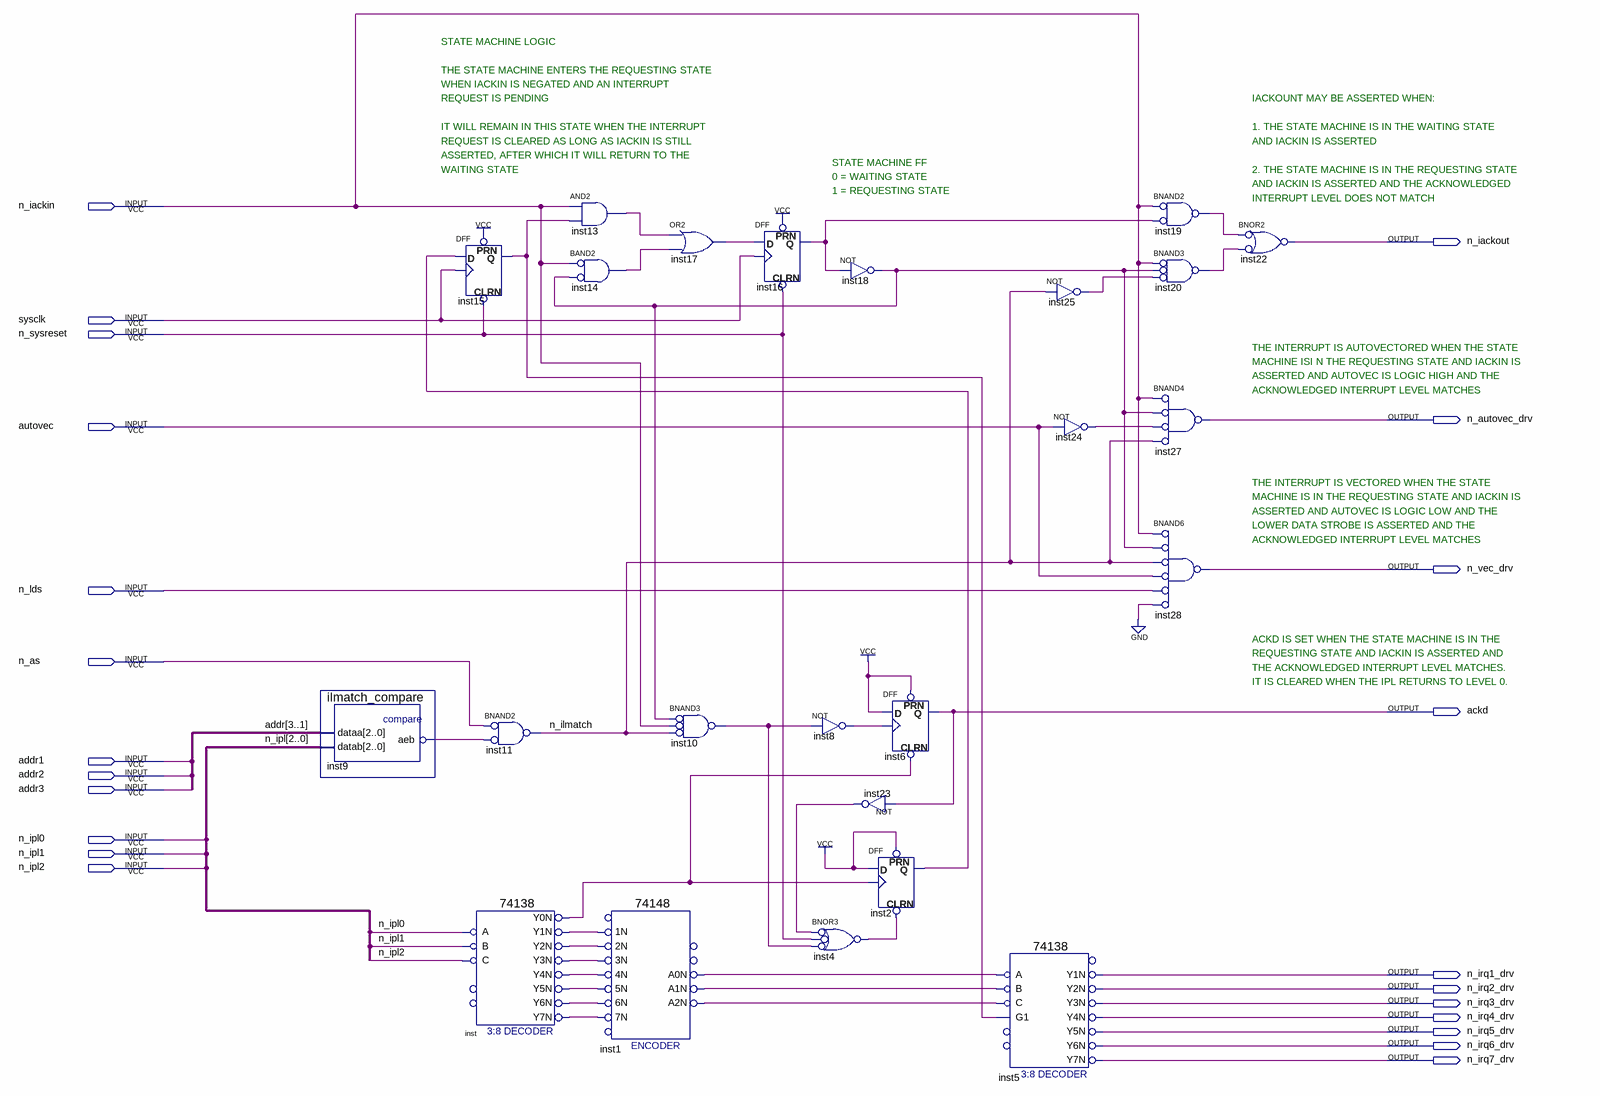
[diagram p0: schematic sheet]
// Quartus schematic Dev_Tool.bdf as structural Verilog: 24 symbols, 23 pins
module Dev_Tool (
  input  n_iackin,
  input  sysclk,
  input  n_sysreset,
  input  autovec,
  input  n_lds,
  input  n_as,
  input  addr1,
  input  addr2,
  input  addr3,
  input  n_ipl0,
  input  n_ipl1,
  input  n_ipl2,
  output n_iackout,
  output n_autovec_drv,
  output n_vec_drv,
  output ackd,
  output n_irq1_drv,
  output n_irq2_drv,
  output n_irq3_drv,
  output n_irq4_drv,
  output n_irq5_drv,
  output n_irq6_drv,
  output n_irq7_drv
);

  wire inst1_a0n, inst1_a1n, inst1_a2n, inst2_q, inst4_out, inst8_out, inst9_aeb, inst9_aeb_inverted_out,
       inst10_out, inst13_out, inst14_out, inst15_q, inst16_q, inst17_out, inst18_out, inst19_out,
       inst20_out, inst23_out, inst24_out, inst25_out, inst_y0n, inst_y1n, inst_y2n, inst_y3n, inst_y4n,
       inst_y5n, inst_y6n, inst_y7n, n_ilmatch;

  ilmatch_compare inst9 (.dataa({addr3, addr2, addr1}), .datab({n_ipl2, n_ipl1, n_ipl0}), .aeb(inst9_aeb));
  not inst9_aeb_inverted (inst9_aeb_inverted_out, inst9_aeb);
  DFF inst15 (.CLRN(n_sysreset), .CLK(sysclk), .D(inst2_q), .PRN(1'b1), .Q(inst15_q));
  \74138  inst (
    .A(~n_ipl0), .B(~n_ipl1), .C(~n_ipl2), .Y0N(inst_y0n), .Y1N(inst_y1n), .Y2N(inst_y2n), .Y3N(inst_y3n),
    .Y4N(inst_y4n), .Y5N(inst_y5n), .Y6N(inst_y6n), .Y7N(inst_y7n));
  nand inst11 (n_ilmatch, ~n_as, ~inst9_aeb_inverted_out);  // BNAND2
  and inst13 (inst13_out, n_iackin, inst15_q);
  and inst14 (inst14_out, ~n_iackin, ~inst18_out);  // BAND2
  \74148  inst1 (
    .\1N (inst_y1n), .\2N (inst_y2n), .\3N (inst_y3n), .\4N (inst_y4n), .\5N (inst_y5n), .\6N (inst_y6n),
    .\7N (inst_y7n), .A0N(inst1_a0n), .A1N(inst1_a1n), .A2N(inst1_a2n));
  or inst17 (inst17_out, inst13_out, inst14_out);
  nand inst10 (inst10_out, ~inst18_out, ~n_iackin, ~n_ilmatch);  // BNAND3
  DFF inst16 (.CLRN(n_sysreset), .CLK(sysclk), .D(inst17_out), .PRN(1'b1), .Q(inst16_q));
  not inst8 (inst8_out, inst10_out);
  nor inst4 (inst4_out, ~inst23_out, ~n_sysreset, ~inst10_out);  // BNOR3
  not inst18 (inst18_out, inst16_q);
  not inst23 (inst23_out, ackd);
  DFF inst2 (.CLRN(inst4_out), .CLK(inst_y0n), .D(1'b1), .PRN(1'b1), .Q(inst2_q));
  DFF inst6 (.CLRN(inst_y0n), .CLK(inst8_out), .D(1'b1), .PRN(1'b1), .Q(ackd));
  \74138  inst5 (
    .A(~inst1_a0n), .B(~inst1_a1n), .C(~inst1_a2n), .G1(inst15_q), .Y1N(n_irq1_drv), .Y2N(n_irq2_drv),
    .Y3N(n_irq3_drv), .Y4N(n_irq4_drv), .Y5N(n_irq5_drv), .Y6N(n_irq6_drv), .Y7N(n_irq7_drv));
  not inst25 (inst25_out, n_ilmatch);
  not inst24 (inst24_out, autovec);
  nand inst19 (inst19_out, ~n_iackin, ~inst16_q);  // BNAND2
  nand inst20 (inst20_out, ~n_iackin, ~inst18_out, ~inst25_out);  // BNAND3
  nand inst27 (n_autovec_drv, ~n_iackin, ~inst18_out, ~inst24_out, ~n_ilmatch);  // BNAND4
  nand inst28 (n_vec_drv, ~n_iackin, ~inst18_out, ~n_ilmatch, ~autovec, ~n_lds, ~1'b0);  // BNAND6
  nor inst22 (n_iackout, ~inst19_out, ~inst20_out);  // BNOR2

  // Notes on the sheet:
  //   STATE MACHINE LOGIC
  //   THE STATE MACHINE ENTERS THE REQUESTING STATE
  //   WHEN IACKIN IS NEGATED AND AN INTERRUPT
  //   REQUEST IS PENDING
  //   IACKOUNT MAY BE ASSERTED WHEN:
  //   IT WILL REMAIN IN THIS STATE WHEN THE INTERRUPT
  //   1. THE STATE MACHINE IS IN THE WAITING STATE
  //   REQUEST IS CLEARED AS LONG AS IACKIN IS STILL
  //   AND IACKIN IS ASSERTED
  //   ASSERTED, AFTER WHICH IT WILL RETURN TO THE
  //   STATE MACHINE FF
  //   WAITING STATE
  //   2. THE STATE MACHINE IS IN THE REQUESTING STATE
  //   0 = WAITING STATE
  //   AND IACKIN IS ASSERTED AND THE ACKNOWLEDGED
  //   1 = REQUESTING STATE
  //   INTERRUPT LEVEL DOES NOT MATCH
  //   THE INTERRUPT IS AUTOVECTORED WHEN THE STATE
  //   MACHINE ISI N THE REQUESTING STATE AND IACKIN IS
  //   ASSERTED AND AUTOVEC IS LOGIC HIGH AND THE
  //   ACKNOWLEDGED INTERRUPT LEVEL MATCHES
  //   THE INTERRUPT IS VECTORED WHEN THE STATE
  //   MACHINE IS IN THE REQUESTING STATE AND IACKIN IS
  //   ASSERTED AND AUTOVEC IS LOGIC LOW AND THE
  //   LOWER DATA STROBE IS ASSERTED AND THE
  //   ACKNOWLEDGED INTERRUPT LEVEL MATCHES
  //   ACKD IS SET WHEN THE STATE MACHINE IS IN THE
  //   REQUESTING STATE AND IACKIN IS ASSERTED AND
  //   THE ACKNOWLEDGED INTERRUPT LEVEL MATCHES.
  //   IT IS CLEARED WHEN THE IPL RETURNS TO LEVEL 0.
endmodule
